# Altium schematic sheet usb_hub.SchDoc
size A4; DocumentNumber: 4; SheetNumber: 4; SheetTotal: 4
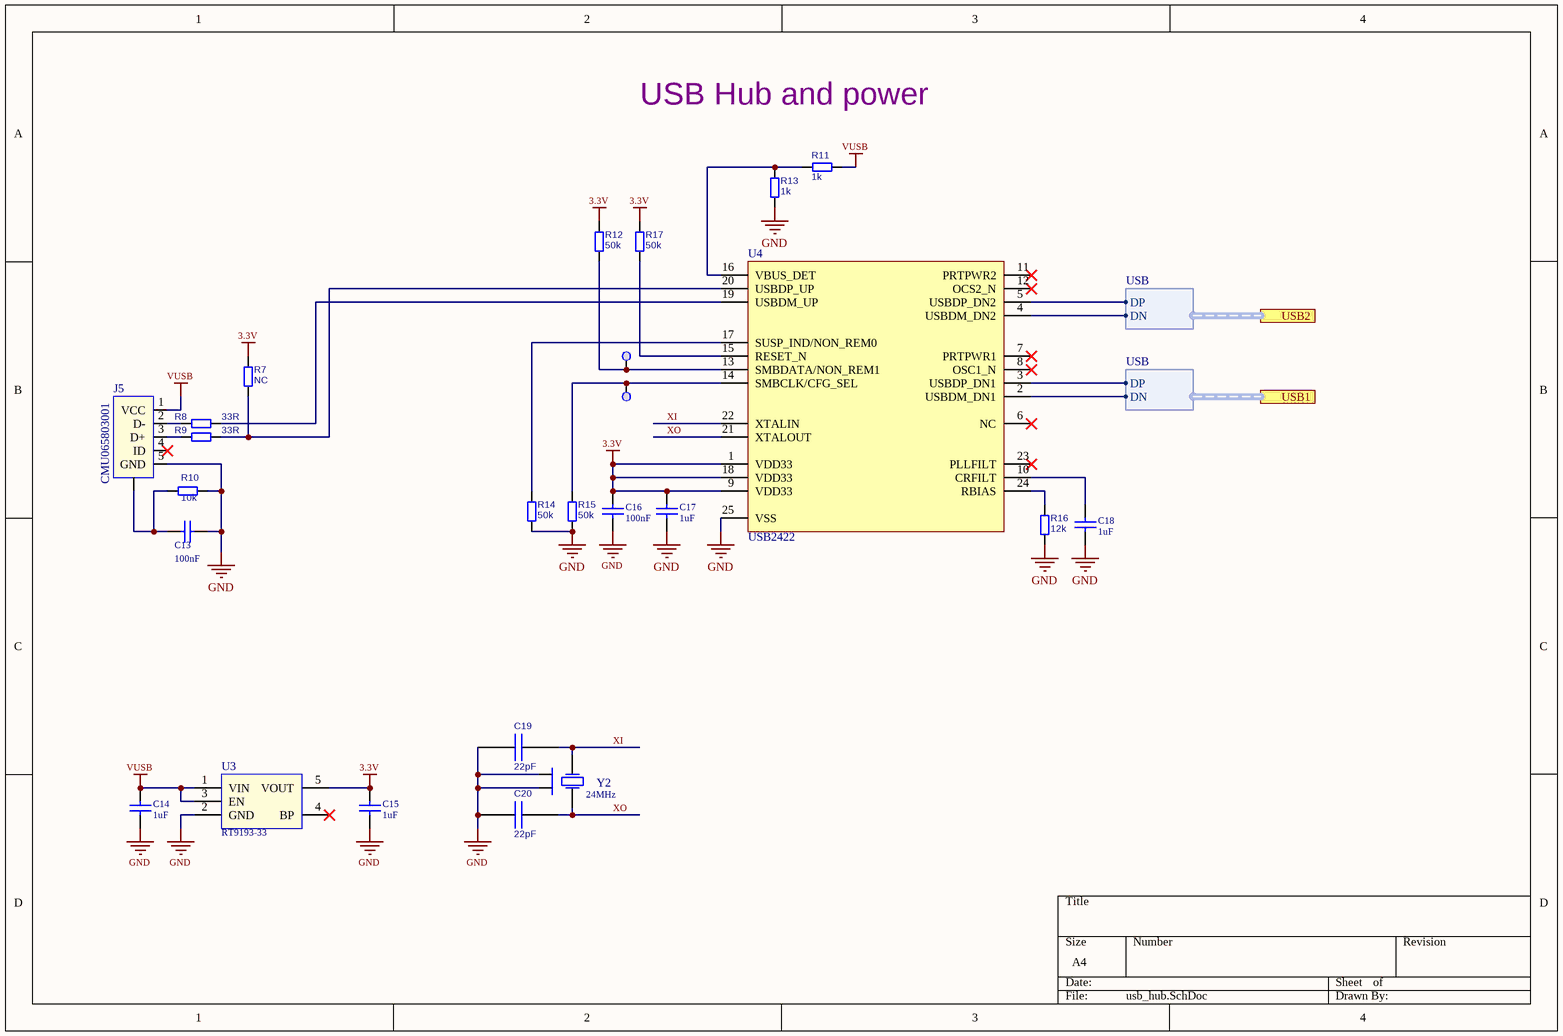
[diagram p0: usb_hub.SchDoc]

## Parts
C13  100nF  [C0402]
C14  1uF  [C0603]
C15  1uF  [C0603]
C16  100nF  [C0402]
C17  1uF  [C0603]
C18  1uF  [C0603]
C19  22pF  [C0402]
C20  22pF  [C0402]
J5  CMU065803001  [CMU065803001]
R7  NC  [R0402]
R8  33R  [R0402]
R9  33R  [R0402]
R10  10k  [R0402]
R11  1k  [R0402]
R12  50k  [R0402]
R13  1k  [R0402]
R14  50k  [R0402]
R15  50k  [R0402]
R16  12k  [R0402]
R17  50k  [R0402]
TP5  TestPoint  [PAD1_07]  (value not drawn)  (no BOM)
TP6  TestPoint  [PAD1_07]  (value not drawn)  (no BOM)
U3  RT9193-33  [SOT23-5]
U4  USB2422  [QFN-24_4040]
Y2  24MHz  [XTAL_3225]

## Ports
USB1 (harness USB), USB2 (harness USB)

## Harnesses
USB: DP, DN

## Nets
3.3V: C15.2 C16.2 C17.2 R7.1(K) R12.2(A) R17.2(A) U3.5(VOUT) U4.1(VDD33) U4.9(VDD33) U4.18(VDD33)
GND: C13.2 C14.1 C15.1 C16.1 C17.1 C18.1 C19.1(P) C20.1(P) J5.5(GND) R10.1(K) R13.1(K) R14.1(K) R15.1(K) R16.1(K) U3.2(GND) U4.25(VSS) Y2.2 Y2.4(X2)
VUSB: C14.2 J5.1(VCC) R11.1(K) U3.1(VIN) U3.3(EN)
XI: C19.2(N) U4.22(XTALIN) Y2.1(X1)
XO: C20.2(N) U4.21(XTALOUT) Y2.3(X2)
NetC13_1: C13.1 J5.0 R10.2(A)
NetC18_2: C18.2 U4.10(CRFILT)
NetJ5_2: J5.2(D-) R8.2(A)
NetJ5_3: J5.3(D+) R9.2(A)
NetR7_2: R7.2(A) R9.1(K) U4.20(USBDP_UP)
NetR8_1: R8.1(K) U4.19(USBDM_UP)
NetR11_2: R11.2(A) R13.2(A) U4.16(VBUS_DET)
NetR12_1: R12.1(K) TP5.1 U4.13(SMBDATA/NON_REM1)
NetR14_2: R14.2(A) U4.17(SUSP_IND/NON_REM0)
NetR15_2: R15.2(A) TP6.1 U4.14(SMBCLK/CFG_SEL)
NetR16_2: R16.2(A) U4.24(RBIAS)
NetR17_1: R17.1(K) U4.15(RESET_N)
NetU4_2: U4.2(USBDM_DN1) ; port USB1.DN
NetU4_3: U4.3(USBDP_DN1) ; port USB1.DP
NetU4_4: U4.4(USBDM_DN2) ; port USB2.DN
NetU4_5: U4.5(USBDP_DN2) ; port USB2.DP

Not connected (* = marked no-connect by the designer): J5 4(ID)*; U3 4(BP)*; U4 6(NC)* 7(PRTPWR1)* 8(OSC1_N)* 11(PRTPWR2)* 12(OCS2_N)* 23(PLLFILT)*

## Notes on the sheet
- USB Hub and power

## Library data of the parts
C13-C18 = Cap: Capacitor; Published: 8-Jun-2000; LatestRevisionDate: 17-Jul-2002; LatestRevisionNote: Re-released for DXP Platform.; PackageReference: RAD-0.3; Publisher: Altium Limited; PackageDescription: Radial Cap, Thru-Hole; 2 Leads; 0.3 in Pin Spacing
  C13 C16: Value: 100nF
  C14 C15 C17 C18: Value: 1uF
C19 C20 = Cap1: Ceramic Capacitor; Type: SMD; ComponentLink1URL: *; ComponentLink1Description: *; Tolerance: *; Value: 22pF
J5 = CMU065803001: MICRO USB 5P FEMALE DIP B -TYPE; Manufacturer: CSCONN; Value: CMU065803001; ComponentLink1Description: Datasheet; ComponentLink1URL: http://www.csconn.com/file/Upload/Upload/CMU065803001.pdf; PartNumber: CMU065803001
R7-R17 = Res: Resistor; ComponentLink1URL: *; ComponentLink1Description: *; Tolerance: *; Type: SMD
  R7: Value: NC
  R8 R9: Value: 33R
  R10: Value: 10k
  R11 R13: Value: 1k
  R12 R14 R15 R17: Value: 50k
  R16: Value: 12k
TP5 TP6 = TestPoint: Test point
U3 = RT9193: 300mA, Ultra-Low Noise, Ultra-Fast CMOS LDO Regulator; Manufacturer: RICHTEK; Value: RT9193; ComponentLink1Description: DataSheet; ComponentLink1URL: http://www.richtek.com/assets/product_file/RT9193/DS9193-16.pdf; PartNumber: RT9193-33
U4 = USB2422: USB 2.0 Hi-Speed 2-port Hub Controller; MAnufacturer: Microchip; Datasheet: https://ww1.microchip.com/downloads/aemDocuments/documents/OTH/ProductDocuments/DataSheets/00001726B.pdf; Evaluation Board: https://ww1.microchip.com/downloads/aemDocuments/documents/OTH/ProductDocuments/BoardDesignFiles/evb2422sch.pdf
Y2 = XTAL_4_PIN: 24Mhz CERAMIC SMD CRYSTAL; Value: 24MHz; ComponentLink1Description: DataSheet